# Altium schematic sheet i2c.SchDoc
size A4
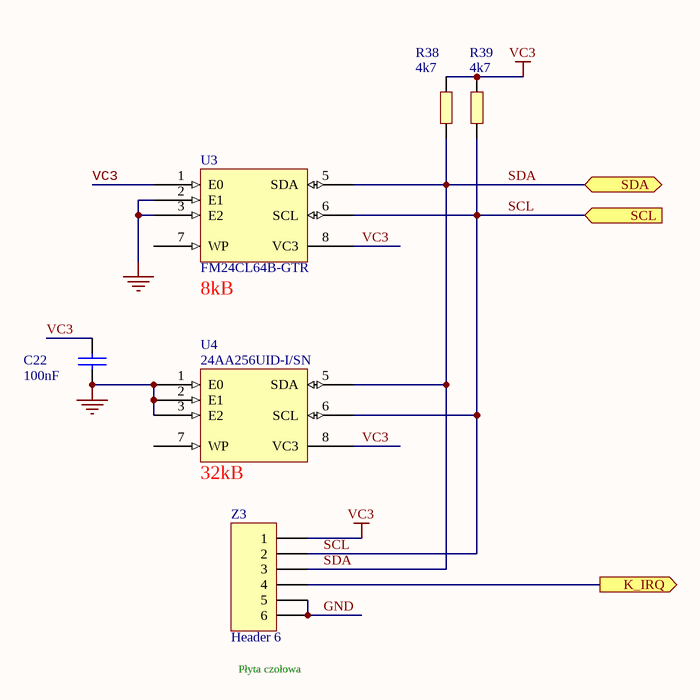
[diagram p0: i2c.SchDoc]

## Parts
C22  100nF  [0603C]
R38  4k7  [0603R]
R39  4k7  [0603R]
U3  FM24CL64B-GTR  [SO8]
U4  24AA256UID-I/SN  [SO8]
Z3  Header 6  [UMATCH-6SMD]

## Ports
K_IRQ (out), SCL (in), SDA (bidir)

## Nets
GND: C22.2 U3.2(E1) U3.3(E2) U3.4(GND) U4.1(E0) U4.2(E1) U4.3(E2) U4.4(GND) Z3.5 Z3.6
VC3: C22.1 R38.1 R39.1 U3.1(E0) U3.8(VC3) U4.8(VC3) Z3.1
K_IRQ: Z3.4 ; port K_IRQ
SCL: R39.2 U3.6(SCL) U4.6(SCL) Z3.2 ; port SCL
SDA: R38.2 U3.5(SDA) U4.5(SDA) Z3.3 ; port SDA

Not connected (* = marked no-connect by the designer): U3 7(WP); U4 7(WP)

## Notes on the sheet
- (near U3) 8kB
- (near U4) 32kB
- (near Z3) Płyta czołowa

## Library data of the parts
C22 = CAP: Capacitor
R38 R39 = RES3
U3 U4 = AT24C02
Z3 = Header 6: Micro Match 6; Dostawca.Symbol: AMP-7-215079-6; Dostawca: TME; LatestRevisionDate: 17-Jul-2002; LatestRevisionNote: Re-released for DXP Platform.; Publisher: Altium Limited